# EAGLE design AD629 shield (EAGLE 9.1.1)
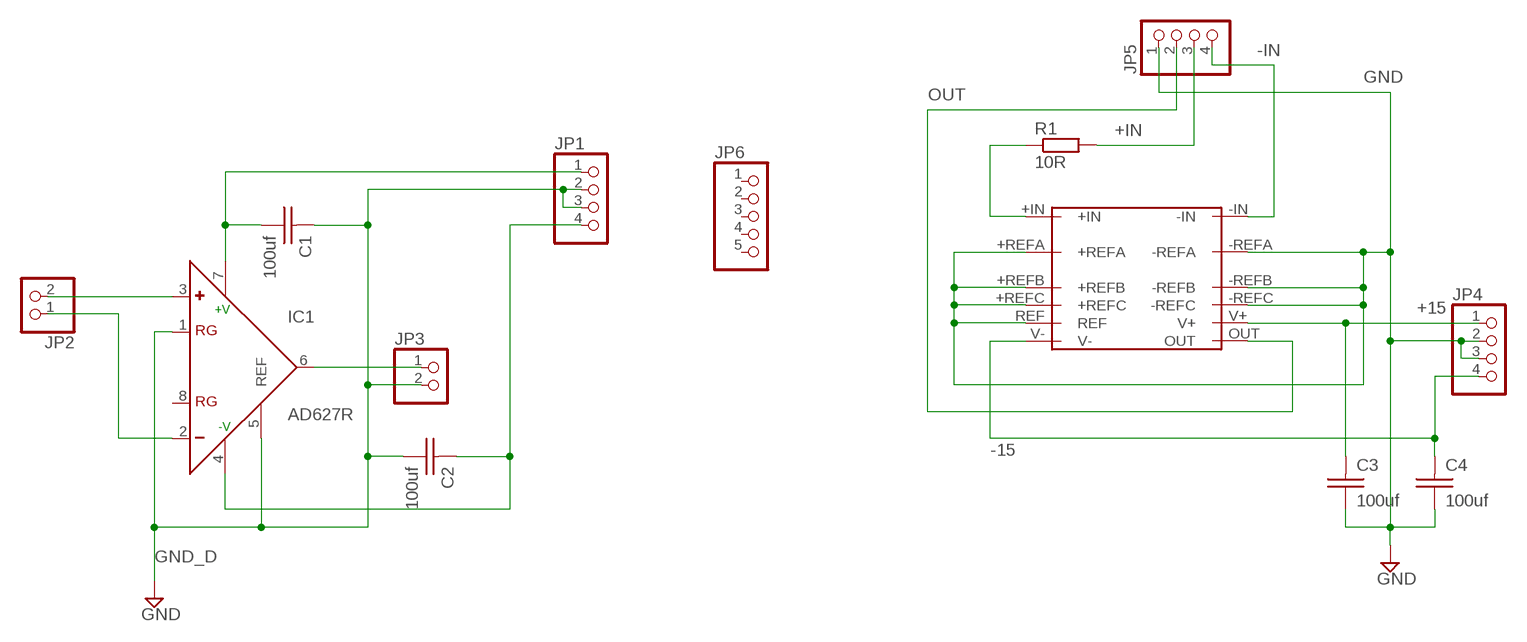
[diagram p0: schematic, sheet 1]

## Parts
C1  100uf  CAP_CERAMICO_SMD  [CAP_CER_SMD-0805]
C2  100uf  CAP_CERAMICO_SMD  [CAP_CER_SMD-0805]
C3  100uf  CAP_CERAMICO_SMD  [CAP_CER_SMD-0805]
C4  100uf  CAP_CERAMICO_SMD  [CAP_CER_SMD-0805]
IC1  AD627R  [SO8]
JP1  PINHD-1X4  [1X04]
JP2  PINHD-1X2  [1X02]
JP3  PINHD-1X2  [1X02]
JP4  PINHD-1X4  [1X04]
JP5  PINHD-1X4  [1X04]
JP6  PINHD-1X5  [1X05]
R1  10R  RESISTORSMD_0805  [RESISTENCIA_0805]
U$1  LT6375  [LT6375_MS16(12)]

## Nets
+15: C3.1 JP4.1 U$1.V+
+IN: JP5.3 R1.2
-15: C4.1 JP4.4 U$1.V-
-IN: JP5.4 U$1.-IN
GND: C3.2 C4.2 JP4.2 JP4.3 JP5.1 U$1.+REFA U$1.+REFB U$1.+REFC U$1.-REFA U$1.-REFB U$1.-REFC U$1.REF
GND_D: C1.1 C2.2 IC1.1(RG) IC1.5(REF) JP1.2 JP1.3 JP3.2 ; supply symbol labelled GND
N$1: IC1.3(+) JP2.2
N$2: IC1.2(-) JP2.1
N$3: C1.2 IC1.7(+V) JP1.1
N$4: C2.1 IC1.4(-V) JP1.4
N$5: IC1.6(OUT) JP3.1
N$11: R1.1 U$1.+IN
OUT: JP5.2 U$1.OUT
Unconnected: IC1.8(RG) JP6.1 JP6.2 JP6.3 JP6.4 JP6.5

## Library data of the parts
C1-C4 = 7DI Library:CAP_CERAMICO: Capacitores ceramicos y de poliester, entre otros
IC1 = analog-devices:AD627: Micropower, Single- and Dual-Supply, Rail-to-Rail Instrumentation Amplifier Source: http://www.analog.com/static/imported-files/data_sheets/AD627.pdf; MPN: AD627AR; OC_FARNELL: 1438354; OC_NEWARK: 09B5402
JP1 JP4 JP5 = pinhead:PINHD-1X4: PIN HEADER
JP2 JP3 = pinhead:PINHD-1X2: PIN HEADER
JP6 = pinhead:PINHD-1X5: PIN HEADER
R1 = 7DI Library:RESISTOR: Resistor con varias variantes
U$1 = 7DI Library:LT6375

## Net classes
0 default: width 0.356 mm

## Board
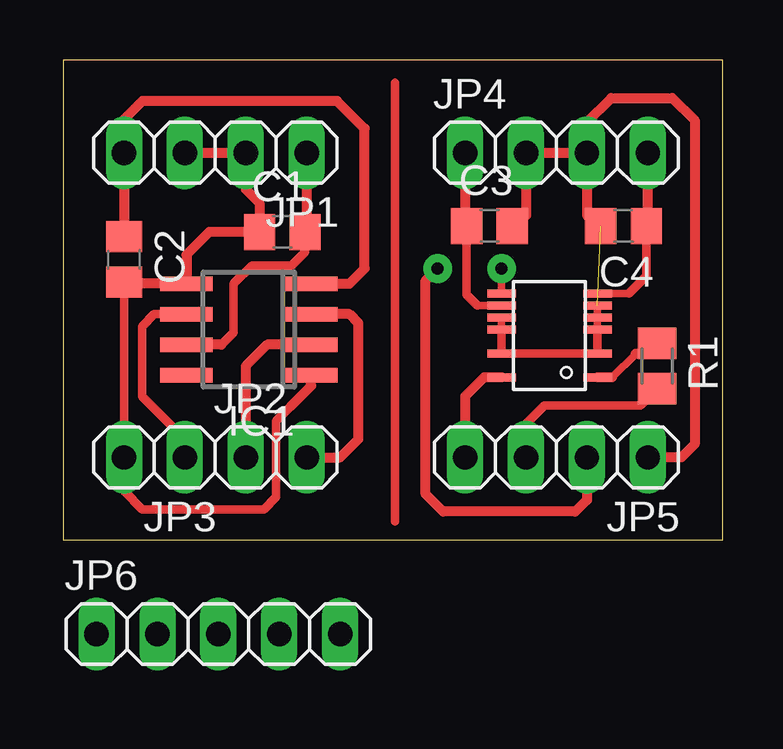
[diagram p1: board, top side]
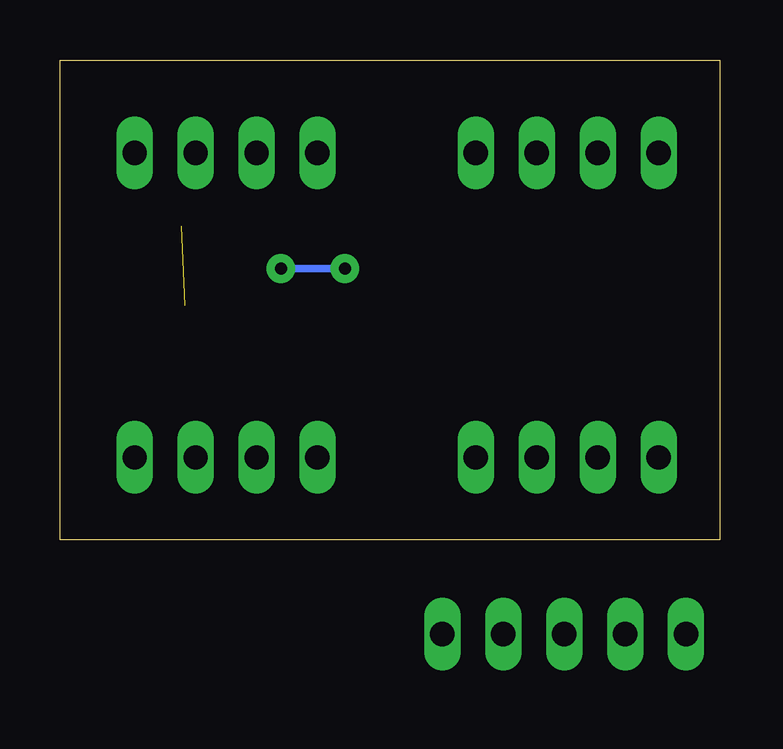
[diagram p2: board, bottom side, seen from below]

Size 27.5 x 20 mm. Coordinates in mm from the lower left corner, seen from the top.
Outline: 0,0 27.5,0 27.5,20 0,20 0,0
Copper layers (1*16): Top 0.035mm / dielectric 1.5mm / Bottom 0.035mm
Design rules "default": minimum track width 6mil, minimum drill 0.35mm, track to track 6mil, track to pad 6mil, pad to pad 6mil, via to via 6mil, smd to smd 6mil, copper to edge 40mil, drill to drill 6mil, minimum pad ring 10mil, minimum via ring 8mil, stop-mask expansion 4mil, vias tented up to drill 0mil, thermal gap 10mil

### Footprints (pad centres in the part's own frame; a part is rotated, then mirrored left to right if it is on the bottom)
CAP_CER_SMD-0805 = smd 1.3 x 1.5: 1 -0.95,0; 2 0.95,0
SO8 = smd 0.6 x 2.2: 1 -1.905,-2.6; 2 -0.635,-2.6; 3 0.635,-2.6; 4 1.905,-2.6; 5 1.905,2.6; 6 0.635,2.6; 7 -0.635,2.6; 8 -1.905,2.6
1X04 = drill 1.016 long: 1 -3.81,0; 2 -1.27,0; 3 1.27,0; 4 3.81,0
1X02 = drill 1.016 long: 1 -1.27,0; 2 1.27,0
1X05 = drill 1.016 long: 1 -5.08,0; 2 -2.54,0; 3 0,0; 4 2.54,0; 5 5.08,0
RESISTENCIA_0805 = smd 1.3 x 1.6: 1 -0.95,0; 2 0.95,0
LT6375_MS16(12) = smd 0.32 x 1.2: +IN -2,-4; +REFA -1,-4; +REFB 0,-4; +REFC 0.5,-4; -IN -2,0; -REFA -1,0; -REFB 0,0; -REFC 0.5,0; OUT 1.5,0; REF 1,-4; V+ 1,0; V- 1.5,-4

### Placement (x,y rotation side)
C1  9.14,12.83 0 top
C2  2.54,11.68 270 top
C3  17.78,13.08 0 top
C4  23.37,13.08 180 top
IC1  7.75,8.76 90 top
JP1  6.35,16.13 180 top
JP2  8.89,3.43 0 top
JP3  3.81,3.43 180 top
JP4  20.57,16.13 0 top
JP5  20.57,3.43 180 top
JP6  6.48,-3.94 0 top  (outside the outline)
R1  24.77,7.24 270 top
U$1  18.29,8.76 90 top

### Tracks (layer width: path | path; a pad name or v marks a point on that pad's centre or on a via)
+15
  Top 0.305: U$1.V+ 17.29,9.76
  Top 0.356: 16.76,12.77 C3.1 16.83,10.22 17.29,9.76
  Top 0.406: JP4.1 16.76,12.77
+IN
  Top 0.356: R1.2 24.06,5.59 20.07,5.59 19.3,4.83 JP5.3
-15
  Top 0.305: U$1.V- 23.6,10.26
  Top 0.356: 24.38,12.77 C4.1 24.32,10.98 23.6,10.26
  Top 0.406: 24.38,12.77 JP4.4
-IN
  Top 0.406: U$1.-IN 17.56,6.76 16.76,5.97 JP5.4
GND  (1 unrouted)
  Top 0.305: U$1.REF U$1.+REFC U$1.+REFB | U$1.-REFB U$1.-REFC
  Top 0.356: U$1.+REFB U$1.+REFA U$1.-REFA U$1.-REFB
  Top 0.406: C3.2 19.3,13.53 JP4.2 JP4.3 | JP4.3 21.84,13.53 C4.2 | JP4.3 21.84,17.4 22.86,18.41 25.4,18.41 26.33,17.48 26.33,3.98 25.78,3.43 JP5.1
  Bottom 0.356: 21.84,14.99 JP4.3
GND_D
  Top 0.356: C2.2 2.54,10.67 JP3.2 2.54,2.03 3.3,1.27 8.38,1.27 8.89,1.78 8.89,4.95 9.53,5.59
  Top 0.406: 2.54,10.67 IC1.5 5.15,11.88 6.1,12.83 C1.1 8.19,14.03 7.62,14.61 JP1.2 JP1.3 | 9.53,5.59 10.35,6.41 IC1.1
N$1
  Top 0.406: JP2.2 11.56,3.43 12.32,4.19 12.32,9.02 11.94,9.4 IC1.3
N$2
  Top 0.406: JP2.1 7.62,7.24 8.51,8.13 IC1.2
N$3
  Top 0.356: 10.16,12.89 C1.2 10.09,12 9.53,11.43 7.87,11.43 7.11,10.67 7.11,8.64 6.6,8.13
  Top 0.406: JP1.1 10.16,12.89 | 6.6,8.13 IC1.7
N$4
  Top 0.406: C2.1 JP1.4 2.54,17.53 3.3,18.29 11.43,18.29 12.57,17.14 12.57,11.3 11.94,10.67 IC1.4
N$5
  Top 0.356: IC1.6 3.81,9.4 3.3,8.89 3.3,5.97 5.08,4.19 JP3.1
N$10
  Top 0.356: 13.84,19.05 13.84,0.76
N$11
  Top 0.305: 23.88,7.75 22.89,6.76
  Top 0.356: R1.1 24.32,7.75
  Top 0.406: 24.32,7.75 23.88,7.75 | 22.89,6.76 U$1.+IN
OUT  (via drill 0.5 pad 1.2)
  Top 0.305: U$1.OUT v18.29,11.3
  Top 0.406: JP5.2 21.84,1.65 21.36,1.17 15.85,1.17 15.11,1.91 15.11,10.79 v15.62,11.3
  Bottom 0.305: v15.62,11.3 v18.29,11.3